# Altium schematic sheet battery_board.SchDoc
size A
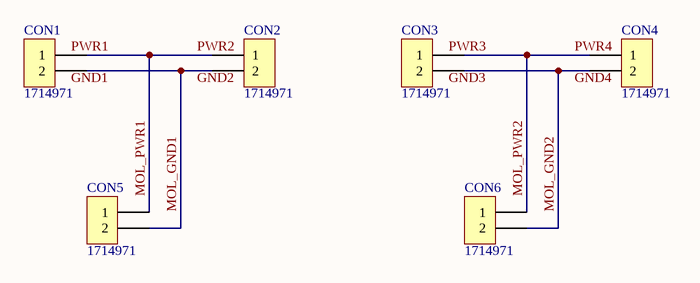
[diagram p0: battery_board.SchDoc]

## Parts
CON1  1714971  [1714971]
CON2  1714971  [1714971]
CON3  1714971  [1714971]
CON4  1714971  [1714971]
CON5  1714971  [1714971]
CON6  1714971  [1714971]

## Nets
MOL_GND1: CON1.2 CON2.2 CON5.2
MOL_GND2: CON3.2 CON4.2 CON6.2
MOL_PWR1: CON1.1 CON2.1 CON5.1  [also labelled PWR2]
MOL_PWR2: CON3.1 CON4.1 CON6.1  [also labelled PWR4]

## Notes on the sheet
- Labels drawn without touching a wire or pin: GND1, GND2, GND3, GND4, PWR1, PWR3

## Library data of the parts
CON1-CON6 = 1714971: 2 position screw terminal block 30A; DigiKey part number: 277-1271-ND